# Altium schematic sheet ControlPlate.SchDoc
size A4; SheetNumber: 1; SheetTotal: 2
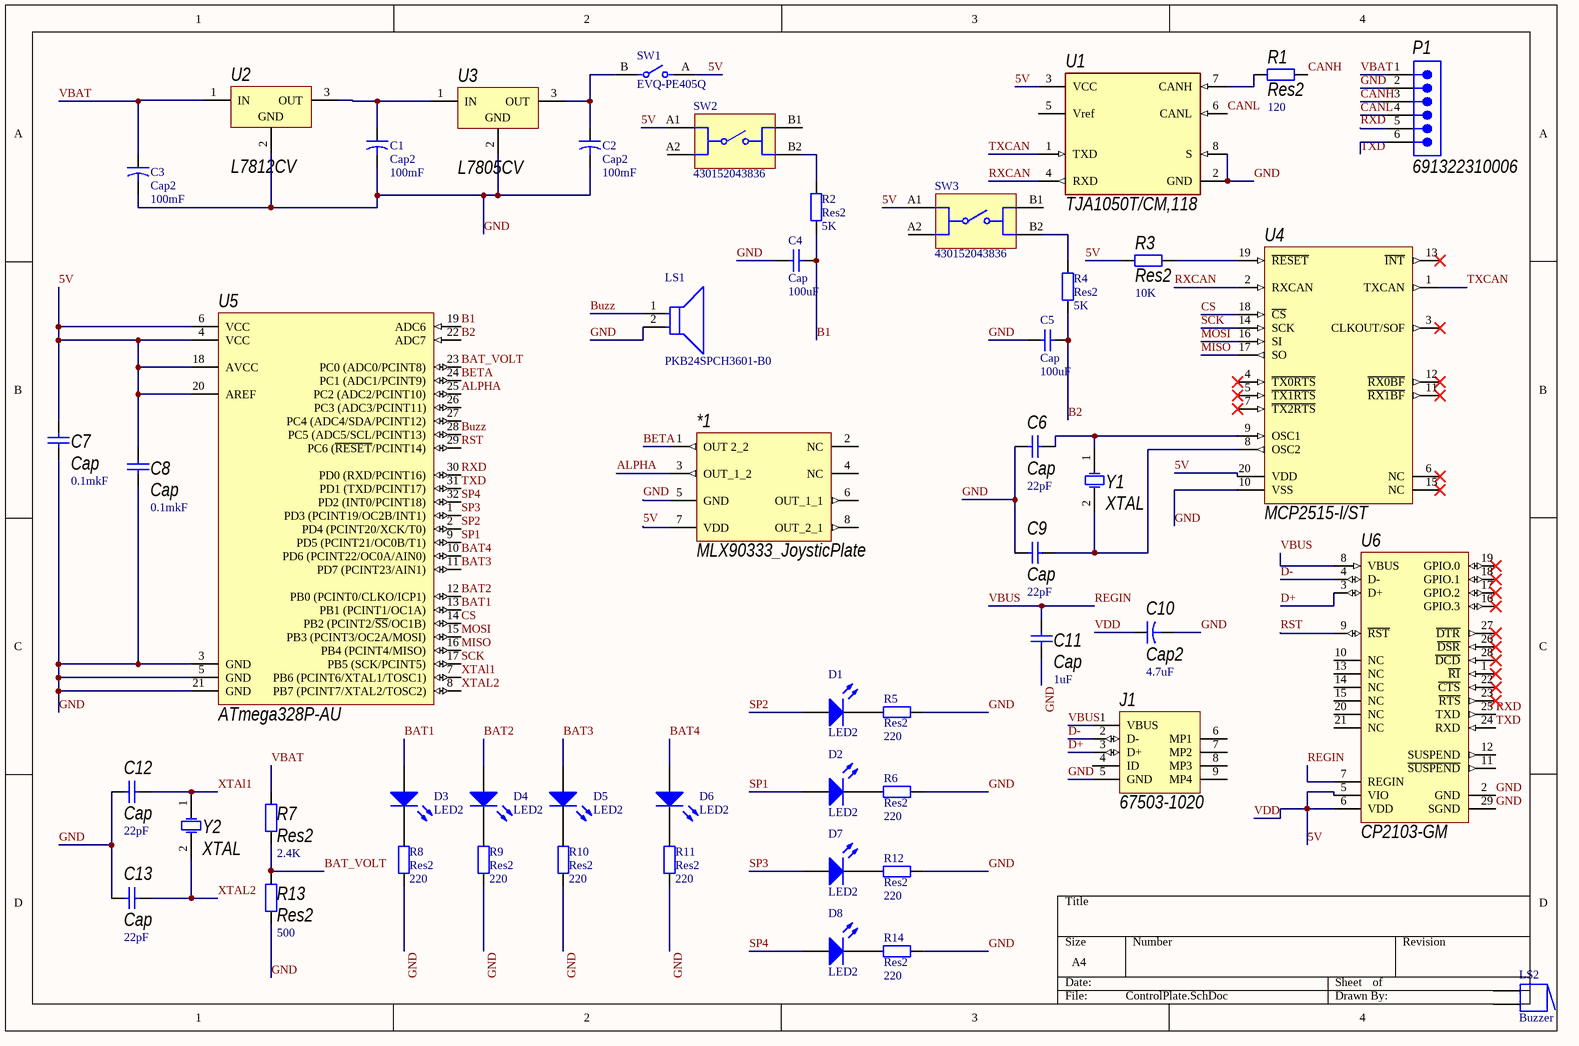
[diagram p0: ControlPlate.SchDoc]

## Parts
*1  MLX90333_JoysticPlate  [MLX90333_Joy]
C1  Cap2  value 100mF  [CAPR5-4X5]
C2  Cap2  value 100mF  [CAPR5-4X5]
C3  Cap2  value 100mF  [CAPR5-4X5]
C4  Cap  value 100uF  [RAD-0.3]
C5  Cap  value 100uF  [RAD-0.3]
C6  Cap  value 22pF  [RAD-0.3]
C7  Cap  value 0.1mkF  [RAD-0.3]
C8  Cap  value 0.1mkF  [RAD-0.3]
C9  Cap  value 22pF  [RAD-0.3]
C10  Cap2  value 4.7uF  [CAPR5-4X5]
C11  Cap  value 1uF  [RAD-0.3]
C12  Cap  value 22pF  [RAD-0.3]
C13  Cap  value 22pF  [RAD-0.3]
D1  LED2  [3.2X1.6X1.1]
D2  LED2  [3.2X1.6X1.1]
D3  LED2  [3.2X1.6X1.1]
D4  LED2  [3.2X1.6X1.1]
D5  LED2  [3.2X1.6X1.1]
D6  LED2  [3.2X1.6X1.1]
D7  LED2  [3.2X1.6X1.1]
D8  LED2  [3.2X1.6X1.1]
J1  67503-1020  [MOLX-67503-1020_V]
LS1  PKB24SPCH3601-B0  [FP-PKB24SPCH3601-B0-MFG]
LS2  Buzzer  [ABSM-1574]
P1  691322310006  [691322310006]
R1  Res2  value 120  [AXIAL-0.4]
R2  Res2  value 5K  [AXIAL-0.4]
R3  Res2  value 10K  [AXIAL-0.4]
R4  Res2  value 5K  [AXIAL-0.4]
R5  Res2  value 220  [AXIAL-0.4]
R6  Res2  value 220  [AXIAL-0.4]
R7  Res2  value 2.4K  [AXIAL-0.4]
R8  Res2  value 220  [AXIAL-0.4]
R9  Res2  value 220  [AXIAL-0.4]
R10  Res2  value 220  [AXIAL-0.4]
R11  Res2  value 220  [AXIAL-0.4]
R12  Res2  value 220  [AXIAL-0.4]
R13  Res2  value 500  [AXIAL-0.4]
R14  Res2  value 220  [AXIAL-0.4]
SW1  EVQ-PE405Q  [FP-EVQ-PE405Q-MFG]
SW2  430152043836  [WS-TASV_L6W6H4.3_4301x20438x6]
SW3  430152043836  [WS-TASV_L6W6H4.3_4301x20438x6]
U1  TJA1050T/CM,118  [FP-SOT96-1-IPC_A]
U2  L7812CV  [TO220]
U3  L7805CV  [TO220]
U4  MCP2515-I/ST  [TSSOP-ST20_N]
U5  ATmega328P-AU  [32A_M]
U6  CP2103-GM  [SLAB-QFN-28-3125x3125TP_A_M]
Y1  XTAL  [R38]
Y2  XTAL  [R38]

## Nets
5V: *1.7(VDD) C7.1 C8.1 C10.1 R3.1 SW1.A SW2.A1 SW3.A1 U1.3(VCC) U4.20(VDD) U5.4(VCC) U5.6(VCC) U5.18(AVCC) U5.20(AREF) U6.5(VIO) U6.6(VDD)  [also labelled VDD]
ALPHA: *1.3(OUT_1_2) U5.25(PC2_(ADC2/PCINT10))
B1: C4.1 R2.2 U5.19(ADC6)
B2: C5.1 R4.2 U5.22(ADC7)
BAT1: D3.1(A) U5.13(PB1_(PCINT1/OC1A))
BAT2: D4.1(A) U5.12(PB0_(PCINT0/CLKO/ICP1))
BAT3: D5.1(A) U5.11(PD7_(PCINT23/AIN1))
BAT4: D6.1(A) U5.10(PD6_(PCINT22/OC0A/AIN0))
BAT_VOLT: R7.2 R13.1 U5.23(PC0_(ADC0/PCINT8))
BETA: *1.1(OUT_2_2) U5.24(PC1_(ADC1/PCINT9))
Buzz: LS1.1(C) U5.28(PC5_(ADC5/SCL/PCINT13))
CANH: P1.3 R1.2
CANL: P1.4 U1.6(CANL)
CS: U4.18(~{CS}) U5.14(PB2_(PCINT2/~{SS}/OC1B))
D+: J1.3(D+) U6.3(D+)
D-: J1.2(D-) U6.4(D-)
GND: *1.5(GND) C1.2 C2.2 C3.2 C4.2 C5.2 C6.1 C7.2 C8.2 C9.1 C10.2 C11.1 C12.1 C13.1 J1.5(GND) LS1.2(A) P1.2 R5.1 R6.1 R8.1 R9.1 R10.1 R11.1 R12.1 R13.2 R14.1 U1.2(GND) U1.8(S) U2.2(GND) U3.2(GND) U4.10(VSS) U5.3(GND) U5.5(GND) U5.21(GND) U6.2(GND) U6.29(SGND)
MISO: U4.17(SO) U5.16(PB4_(PCINT4/MISO))
MOSI: U4.16(SI) U5.15(PB3_(PCINT3/OC2A/MOSI))
REGIN: C11.2 J1.1(VBUS) U6.7(REGIN) U6.8(VBUS)  [also labelled VBUS]
RST: U5.29(PC6_(~{RESET}/PCINT14)) U6.9(~{RST})
RXCAN: U1.4(RXD) U4.2(RXCAN)
RXD: P1.5 U5.30(PD0_(RXD/PCINT16)) U6.25(TXD)
SCK: U4.14(SCK) U5.17(PB5_(SCK/PCINT5))
SP1: D2.1(A) U5.9(PD5_(PCINT21/OC0B/T1))
SP2: D1.1(A) U5.2(PD4_(PCINT20/XCK/T0))
SP3: D7.1(A) U5.1(PD3_(PCINT19/OC2B/INT1))
SP4: D8.1(A) U5.32(PD2_(INT0/PCINT18))
TXCAN: U1.1(TXD) U4.1(TXCAN)
TXD: P1.6 U5.31(PD1_(TXD/PCINT17)) U6.24(RXD)
VBAT: C3.1 P1.1 R7.1 U2.1(IN)
XTAl1: C12.2 U5.7(PB6_(PCINT6/XTAL1/TOSC1)) Y2.1(OSC1)
XTAL2: C13.2 U5.8(PB7_(PCINT7/XTAL2/TOSC2)) Y2.2(OSC2)
NetC1_1: C1.1 U2.3(OUT) U3.1(IN)
NetC2_1: C2.1 SW1.B U3.3(OUT)
NetC6_2: C6.2 U4.9(OSC1) Y1.1(OSC1)
NetC9_2: C9.2 U4.8(OSC2) Y1.2(OSC2)
NetD1_2: D1.2(K) R5.2
NetD2_2: D2.2(K) R6.2
NetD3_2: D3.2(K) R8.2
NetD4_2: D4.2(K) R9.2
NetD5_2: D5.2(K) R10.2
NetD6_2: D6.2(K) R11.2
NetD7_2: D7.2(K) R12.2
NetD8_2: D8.2(K) R14.2
NetLS2_1: LS2.1 LS2.1A
NetLS2_2: LS2.2 LS2.2A
NetR1_1: R1.1 U1.7(CANH)
NetR2_1: R2.1 SW2.B2
NetR3_2: R3.2 U4.19(~{RESET})
NetR4_1: R4.1 SW3.B2

Not connected (* = marked no-connect by the designer): *1 2(NC) 4(NC) 6(OUT_1_1) 8(OUT_2_1); J1 4(ID) 6(MP1) 7(MP2) 8(MP3) 9(MP4); SW2 A2 B1; SW3 A2 B1; U1 5(Vref); U4 3(CLKOUT/SOF)* 4(~{TX0RTS})* 5(~{TX1RTS})* 6(NC)* 7(~{TX2RTS})* 11(~{RX1BF})* 12(~{RX0BF})* 13(~{INT})* 15(NC)*; U5 26(PC3_(ADC3/PCINT11)) 27(PC4_(ADC4/SDA/PCINT12)); U6 1(~{RI})* 10(NC) 11(~{SUSPEND}) 12(SUSPEND) 13(NC) 14(NC) 15(NC) 16(GPIO.3)* 17(GPIO.2)* 18(GPIO.1)* 19(GPIO.0)* 20(NC) 21(NC) 22(~{CTS})* 23(~{RTS})* 26(~{DSR})* 27(~{DTR})* 28(~{DCD})*

## Library data of the parts
C1-C3 C10 = Cap2: Capacitor; Published: 23-Sep-2002; PackageReference: CAPR5-4X5; Publisher: Altium Limited; PackageDescription: Capacitor; 2 Leads
C4-C9 C11-C13 = Cap: Capacitor; Published: 8-Jun-2000; LatestRevisionDate: 17-Jul-2002; LatestRevisionNote: Re-released for DXP Platform.; PackageReference: RAD-0.3; Publisher: Altium Limited; PackageDescription: Radial Cap, Thru-Hole; 2 Leads; 0.3 in Pin Spacing
D1-D8 = LED2: Typical RED, GREEN, YELLOW, AMBER GaAs LED; Published: 8-Jun-2000; LatestRevisionDate: 17-Jul-2002; LatestRevisionNote: Re-released for DXP Platform.; PackageVersion: Feb-2002; PackageReference: 3.2X1.6X1.1; Publisher: Altium Limited; PackageDescription: SM LED; 2 Flat Leads
J1 = CMP-0411-00002-1: USB, MINI, SMD, RA KME04-USBMU03A01; Manufacturer: Molex; ComponentLink1URL: http://www.molex.com/; PartNumber: 67503-1020; Mounting Technology: Surface Mount; ComponentLink1Description: Manufacturer URL; Terminal Pitch: 0.8 mm; DatasheetVersion: Rev F, 06/2009; ComponentLink2Description: Datasheet; PackageDescription: Mini USB Connector, SMT, Righer Angle; ComponentLink2URL: http://www.molex.com/pdm_docs/sd/675031020_sd.pdf; PackageReference: 67503-1020
LS1 = CMP-06203-000001-2: AUDIO PIEZO TRANSDUCER 3-15V TH; Self Resonant Frequency: 3.6kHz; Voltage Rating (DC): 15V; Min Supply Voltage: 3V; Operating Supply Current: 16mA; Voltage Rating: 12V; Max Frequency: 4.1kHz; Washable: No; REACH SVHC: No SVHC; Packaging: Bulk; Frequency: 3.6kHz; Max Operating Temperature: 70°C; Max Supply Voltage: 15V; Max Supply Voltage (DC): 15V; Diameter: 24.3mm; Lead Free: Lead Free; Radiation Hardening: No; Nominal Supply Current: 16mA; Height: 9.7mm; Mount: Flush; Nominal Supply Voltage (DC): 12V; Min Operating Temperature: -20°C; Termination: PC Pins; Length: 24.3mm; Package Quantity: 650; Min Supply Voltage (DC): 3V; Max Supply Current: 16mA
LS2 = Buzzer: Magnetic Transducer Buzzer; Published: 24-Mar-1999; LatestRevisionDate: 17-Dec-2003; LatestRevisionNote: Schematic revised, PCB Footprint replaced.; DatasheetVersion: 17-Dec-2003; PackageReference: ABSM-1574; Publisher: Altium Limited; PackageDescription: Magnetic Transducer Buzzer; ComponentLink1Description: Manufacturer Link; ComponentLink1URL: http://www.megastar.com/linecard/buzzmode/index.php
P1 = CMP-1502-01890-2: NexarPartId: 8917781; Number of Contacts: 6; Number of Levels: 1; Voltage: 300V; Current: 10A; Gender: Male; Pitch: 3.81mm; Width: 24.25mm; Length: 10.5mm; Number of Pins: 6; Contact Material: Brass; Number of Rows: 1; Lead Pitch: 3.81mm; REACH SVHC: No SVHC; Color: Green; RoHS: Compliant; Number of Positions Per Level: 6; Height: 9.2mm; Packaging: Box; Termination: Solder; Mount: Through Hole; Contact Plating: Tin
R1-R14 = Res2: Resistor; Published: 8-Jun-2000; LatestRevisionDate: 17-Jul-2002; LatestRevisionNote: Re-released for DXP Platform.; PackageReference: AXIAL-0.4; Publisher: Altium Limited; PackageDescription: Axial Device, Thru-Hole; 2 Leads; 0.4 in Pin Spacing
SW1 = CMP-05618-000107-1: SWITCH TACTILE SPST-NO 0.05A 12V; Mechanical Life: 50000Cycles; Actuator Type: Standard; Actuator Color: Grey; Contact Current Rating: 50mA; Switch Function: Off-Mom; Switch Travel: 0.25mm; Actuator Length: 1.5mm; Operating Force: 1N; Illumination Type: Non-Illuminated; Throw Configuration: SPST; Contact Resistance: 100mR; Mount: Through Hole; Contact Plating: Silver; Max Operating Temperature: 85°C; Max Voltage Rating (DC): 12V; Electrical Life: 50000Cycles; Current Rating: 50mA; Series: EVQPE; Length: 6mm; Size: 3.5mm; Packaging: Bulk; Termination: PC Pin; Min Operating Temperature: -30°C; Lead Free: Lead Free; Height: 5mm; Voltage Rating (DC): 12V; REACH SVHC: No SVHC; Width: 3.5mm; Package Quantity: 1000; Depth: 7.9mm; Max Current Rating: 50mA; Orientation: Straight
SW2 SW3 = CMP-1452-00002-2: NexarPartId: 22861785; Voltage Rating: 12V; Current Rating: 50mA; Switch Travel: 250µm; Switch Function: Off-Mom; Actuator Material: Liquid Crystal Polymer, Polymer; Insulation Resistance: 100MΩ; Actuator Length: 900µm; Throw Configuration: SPST; Mechanical Life: 200kcycles; Illumination Type: Illuminated, Non-Illuminated; Mount: Surface Mount; Max Operating Temperature: 85°C; Height: 4.3mm; RoHS: Compliant; Length: 6.2mm; Color: Orange; Width: 6.2mm; Contact Current Rating: 50mA; Diameter: 3.5mm; Termination: Gull Wing; Packaging: Tape and Reel; REACH SVHC: No SVHC; Contact Plating: Silver; Min Operating Temperature: -40°C; Contact Material: Stainless Steel, Steel
U1 = CMP-2000-04923-2: IC TRANSCEIVER HALF 1/1 8SO; Simplex/Duplex: Half Duplex; Max Supply Current: 10mA; Number of Receive Buffers: 1; Min Supply Voltage: 4.75V; Max Supply Voltage: 5.25V; Interface: CAN; Data Rate: 1Mbps; Receiver Hysteresis: 70mV; Number of Transmit Buffers: 1; Min Operating Temperature: -40°C; Case/Package: SO; REACH SVHC: No SVHC; Max Operating Temperature: 150°C; Number of Pins: 8; Lead Free: Lead Free; Number of Transceivers: 1; Packaging: Tape and Reel; Mount: Surface Mount; Radiation Hardening: No; Nominal Supply Current: 10mA; Package Quantity: 2500; Contact Plating: Gold
U2 = CMP-0244-00450-1: Positive Voltage Regulator, 12V, 3-Pin TO-220; PackageDescription: TO, Thru-Hole, Vertical, Heatsink Mounted; 3 In-Line Leads; Pitch 2.54 mm; ComponentLink3URL: http://www.st.com/internet/com/TECHNICAL_RESOURCES/TECHNICAL_LITERATURE/PACKAGE_INFORMATION/CD00004649.pdf; ComponentLink1URL: http://www.st.com; ComponentLink2Description: Datasheet; ComponentLink3Description: Package Specification; ComponentLink2URL: http://www.st.com/internet/com/TECHNICAL_RESOURCES/TECHNICAL_LITERATURE/DATASHEET/CD00000444.pdf; DatasheetVersion: 16/11/2011; PackageVersion: ver3.0; PackageReference: TO220; ComponentLink1Description: Manufacturer URL
U3 = CMP-0244-00483-1: Positive Voltage Regulator, 5V, 3-Pin TO-220; PackageDescription: TO, Thru-Hole, Vertical, Heatsink Mounted; 3 In-Line Leads; Pitch 2.54 mm; ComponentLink2Description: Datasheet; PackageReference: TO220; ComponentLink3URL: http://www.st.com/internet/com/TECHNICAL_RESOURCES/TECHNICAL_LITERATURE/PACKAGE_INFORMATION/CD00004649.pdf; DatasheetVersion: 16/11/2011; ComponentLink1Description: Manufacturer URL; ComponentLink1URL: http://www.st.com; PackageVersion: ver3.0; ComponentLink3Description: Package Specification; ComponentLink2URL: http://www.st.com/internet/com/TECHNICAL_RESOURCES/TECHNICAL_LITERATURE/DATASHEET/CD00000444.pdf
U4 = CMP-0186-00077-2: Stand-Alone CAN Controller With SPI Interface, 20-Pin TSSOP, Industrial Temperature; DatasheetVersion: revF, Oct-2010; ComponentLink1Description: Manufacturer URL; PackageDescription: 20-Lead Plastic Thin Shrink Small Outline (ST) - 4.4mm Body [TSSOP]; ComponentLink1URL: http://www.microchip.com/; RevisionNote: URLs added. DatasheetVersion updated.; PackageReference: TSSOP-ST20; Code_JEDEC: MO-153-AC; ComponentLink2Description: Datasheet; ComponentLink2URL: http://ww1.microchip.com/downloads/en/DeviceDoc/21801f.pdf; PackageVersion: revBB, Aug-2009; ComponentLink3URL: http://www.microchip.com/stellent/groups/techpub_sg/documents/packagingspec/en012702.pdf; ComponentLink3Description: Package Specification
U5 = CMP-0095-00269-2: 8-bit AVR Microcontroller, 32KB Flash, 1KB EEPROM, 2KB SRAM, 32-pin TQFP, Industrial Grade (-40°C to 85°C); PackageDescription: 32-Lead, 7x7x1.0 mm Body, 0.8mm Lead Pitch, Thin Profile Plastic Quad Flat Package (TQFP); DatasheetVersion: revD, May-2011; RevisionNote: DatasheetVersion & PackageVersion updated. URLs added.; ComponentLink1URL: http://www.atmel.com/; ComponentLink2Description: ATmega48A/48PA/88A/88PA/168A/168PA/328/328P Datasheet; Code_JEDEC: MS-026-ABA; ComponentLink1Description: Manufacturer URL; PackageReference: 32A; ComponentLink3Description: ATmega48A/48PA/88A/88PA/168A/168PA/328/328P Summary; ComponentLink2URL: http://www.atmel.com/dyn/resources/prod_documents/doc8271.pdf; PackageVersion: revC, Oct-2010; ComponentLink3URL: http://www.atmel.com/dyn/resources/prod_documents/8271S.pdf
U6 = CMP-0511-00006-1: Single-Chip USB to UART Bridge, 1024 Bytes EEPROM, -40 to 85 degC, 28-pin QFN, Tube; Manufacturer: Silicon Labs; Internal Oscillator: TRUE; Sub-Family: USB Bridges; PackageDescription: 28-Pin Quad-Flat No-Leads Package, Body 5 x 5 mm, Pitch 0.5 mm; PartNumber: CP2103-GM; ComponentLink2Description: Datasheet; ComponentLink2URL: http://www.silabs.com/Support%20Documents/TechnicalDocs/CP2103.pdf; ComponentLink1URL: http://www.silabs.com/; Mounting Technology: Surface Mount; ComponentLink1Description: Manufacturer URL; PackageReference: QFN-28; EEPROM: 1024 Bytes; DatasheetVersion: Rev. 1.0; ComponentLink3Description: Package Specification; ComponentLink3URL: http://www.silabs.com/Support%20Documents/TechnicalDocs/C8051F35x.pdf
Y1 Y2 = XTAL: Crystal Oscillator; Published: 8-Jun-2000; LatestRevisionDate: 17-Jul-2002; LatestRevisionNote: Re-released for DXP Platform.; PackageReference: R38; Publisher: Altium Limited; PackageDescription: Crystal, Thru-Hole; 2 Leads; Body 3.1 x 8.2 mm (Dia.xH)